# EAGLE schematic mrShark 01.a (EAGLE 6.1)
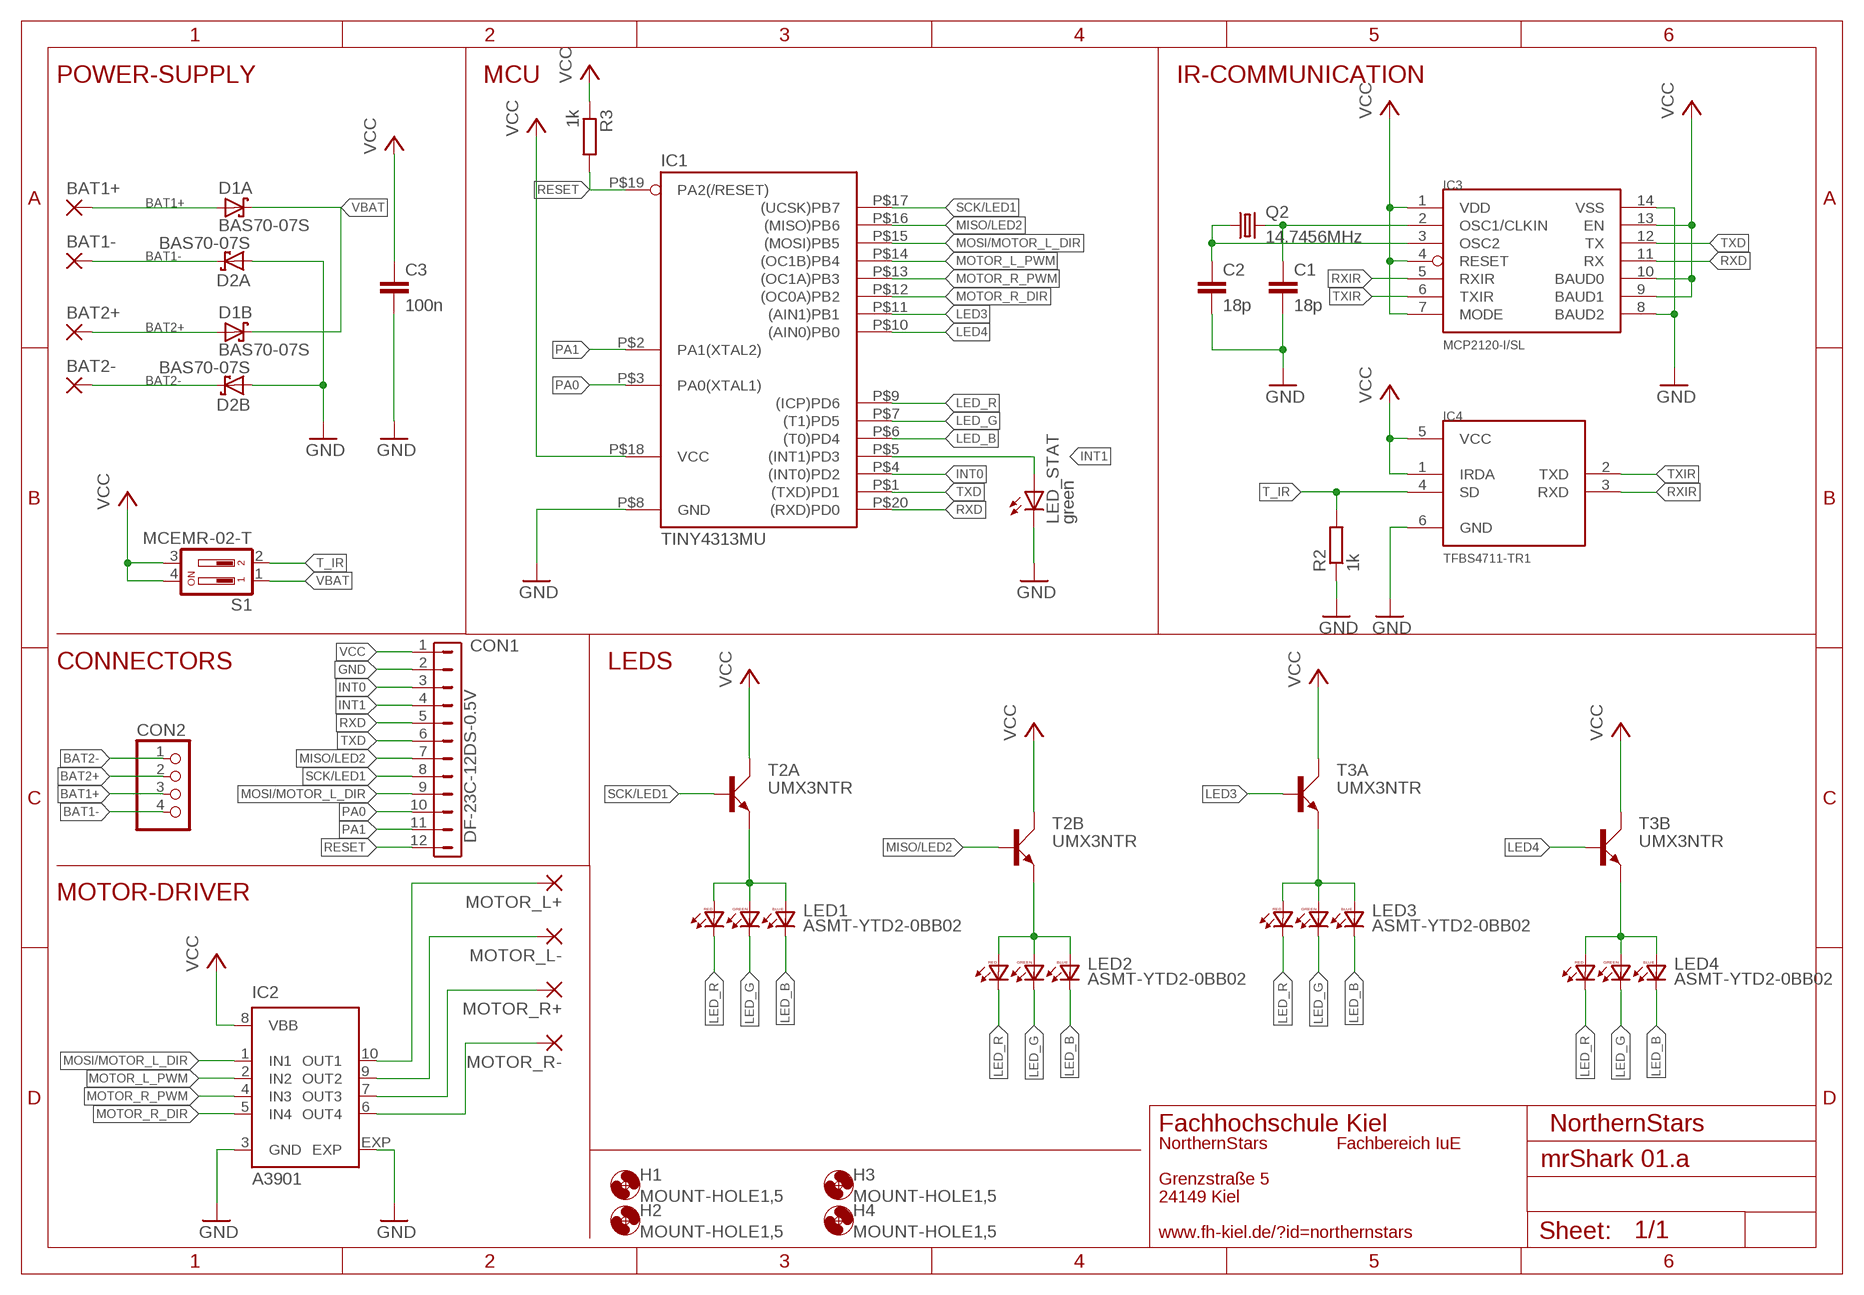
[diagram p0: schematic, sheet 1]

## Parts
BAT1+  SMD1  [SMD0,635-1,27]
BAT1-  SMD1  [SMD0,635-1,27]
BAT2+  SMD1  [SMD0,635-1,27]
BAT2-  SMD1  [SMD0,635-1,27]
C1  18p  C-EUC0402K  [C0402K]
C2  18p  C-EUC0402K  [C0402K]
C3  100n  C-EUC0402K  [C0402K]
CON1  DF-23C-12DS-0.5V  [DF23C-12DS]
CON2  PINHD-1X04_2.54-S  [1X04-S]
D1  BAS70-07S  [SOT363_PHILIPS]
D2  BAS70-07S  [SOT363_PHILIPS]
H1  MOUNT-HOLE1,5  [1,5]
H2  MOUNT-HOLE1,5  [1,5]
H3  MOUNT-HOLE1,5  [1,5]
H4  MOUNT-HOLE1,5  [1,5]
IC1  TINY4313MU  [MLF20]
IC2  A3901  [DFN10-3X3]
IC3  MCP2120-I/SL  MCP2120  [SO-14]
IC4  TFBS4711-TR1  TFBS4711TR1  [TFBS4711]
LED1  ASMT-YTD2-0BB02  PLCC6  [PLCC6]
LED2  ASMT-YTD2-0BB02  PLCC6  [PLCC6]
LED3  ASMT-YTD2-0BB02  PLCC6  [PLCC6]
LED4  ASMT-YTD2-0BB02  PLCC6  [PLCC6]
LED_STAT  green  LEDCHIP-LED0603  [CHIP-LED0603]
MOTOR_L+  SMD1  [SMD0,635-1,27]
MOTOR_L-  SMD1  [SMD0,635-1,27]
MOTOR_R+  SMD1  [SMD0,635-1,27]
MOTOR_R-  SMD1  [SMD0,635-1,27]
Q2  14.7456MHz  CRYSTALCFPX-104  [CFPX-104]
R2  1k  R-EU_R0402  [R0402]
R3  1k  R-EU_R0402  [R0402]
S1  MCEMR-02-T  219-02  [CTS-219-02]
T2  UMX3NTR  UMX3NTR-SOT363  [SOT363_INFINEON]
T3  UMX3NTR  UMX3NTR-SOT363  [SOT363_INFINEON]

## Nets
BAT1+: BAT1+.P$1(P) CON2.3 D1.1(A:A)
BAT1-: BAT1-.P$1(P) CON2.4 D2.6(A:C)
BAT2+: BAT2+.P$1(P) CON2.2 D1.4(B:A)
BAT2-: BAT2-.P$1(P) CON2.1 D2.3(B:C)
GND: C1.2 C2.2 C3.2 CON1.2 D2.1(A:A) D2.4(B:A) IC1.P$8(GND) IC2.3(GND) IC2.EXP IC3.8(BAUD2) IC3.14(VSS) IC4.6(GND) LED_STAT.C R2.1
INT0: CON1.3 IC1.P$4((INT0)PD2)
INT1: CON1.4 IC1.P$5((INT1)PD3) LED_STAT.A
LED1+: LED1.4(RA) LED1.5(GA) LED1.6(BA) T2.1(A:E)
LED2+: LED2.4(RA) LED2.5(GA) LED2.6(BA) T2.5(B:E)
LED3: IC1.P$11((AIN1)PB1) T3.2(A:B)
LED3+: LED3.4(RA) LED3.5(GA) LED3.6(BA) T3.1(A:E)
LED4: IC1.P$10((AIN0)PB0) T3.3(B:B)
LED4+: LED4.4(RA) LED4.5(GA) LED4.6(BA) T3.5(B:E)
LED_B: IC1.P$6((T0)PD4) LED1.1(BC) LED2.1(BC) LED3.1(BC) LED4.1(BC)
LED_G: IC1.P$7((T1)PD5) LED1.2(GC) LED2.2(GC) LED3.2(GC) LED4.2(GC)
LED_R: IC1.P$9((ICP)PD6) LED1.3(RC) LED2.3(RC) LED3.3(RC) LED4.3(RC)
MISO/LED2: CON1.7 IC1.P$16((MISO)PB6) T2.3(B:B)
MOSI/MOTOR_L_DIR: CON1.9 IC1.P$15((MOSI)PB5) IC2.1(IN1)
MOTOR_L+: IC2.10(OUT1) MOTOR_L+.P$1(P)
MOTOR_L-: IC2.9(OUT2) MOTOR_L-.P$1(P)
MOTOR_L_PWM: IC1.P$14((OC1B)PB4) IC2.2(IN2)
MOTOR_R+: IC2.7(OUT3) MOTOR_R+.P$1(P)
MOTOR_R-: IC2.6(OUT4) MOTOR_R-.P$1(P)
MOTOR_R_DIR: IC1.P$12((OC0A)PB2) IC2.5(IN4)
MOTOR_R_PWM: IC1.P$13((OC1A)PB3) IC2.4(IN3)
N$1: C2.1 IC3.3(OSC2) Q2.P$1
N$2: C1.1 IC3.2(OSC1/CLKIN) Q2.P$2
PA0: CON1.10 IC1.P$3(PA0(XTAL1))
PA1: CON1.11 IC1.P$2(PA1(XTAL2))
RESET: CON1.12 IC1.P$19(PA2(/RESET)) R3.2
RXD: CON1.5 IC1.P$20((RXD)PD0) IC3.11(RX)
RXIR: IC3.5(RXIR) IC4.3(RXD)
SCK/LED1: CON1.8 IC1.P$17((UCSK)PB7) T2.2(A:B)
T_IR: IC4.4(SD) R2.2 S1.2
TXD: CON1.6 IC1.P$1((TXD)PD1) IC3.12(TX)
TXIR: IC3.6(TXIR) IC4.2(TXD)
VBAT: D1.3(B:C) D1.6(A:C) S1.1
VCC: C3.1 CON1.1 IC1.P$18(VCC) IC2.8(VBB) IC3.1(VDD) IC3.4(RESET) IC3.7(MODE) IC3.9(BAUD1) IC3.10(BAUD0) IC3.13(EN) IC4.1(IRDA) IC4.5(VCC) R3.1 S1.3 S1.4 T2.4(B:C) T2.6(A:C) T3.4(B:C) T3.6(A:C)

## Notes on the sheet
- POWER-SUPPLY | MCU | IR-COMMUNICATION
- CONNECTORS | LEDS
- MOTOR-DRIVER
- Fachhochschule Kiel | NorthernStars
- NorthernStars | Fachbereich IuE
- Grenzstraße 5
- 24149 Kiel
- www.fh-kiel.de/?id=northernstars

## Library data of the parts
BAT1+ BAT1- BAT2+ BAT2- MOTOR_L+ MOTOR_L- MOTOR_R+ MOTOR_R- = wirepad:SMD1: SMD PAD Size: 0,635x1,27mm
C1-C3 = rcl:C-EU: CAPACITOR, European symbol
CON1 = con-hirose:DF-23C-12DS: Low-Profile Board-to-Board/Board-to-FPC Connectors 0.5mm Pitch 12-Pins Steckbuchse
CON2 = pinhead-2:PINHD-1X04: PIN HEADER
D1 D2 = diode:BAS70-07: Silicon Schottky Diodes General-purpose diode for high-speed switching Source: BAS70_1PS7XSB70_SER_8.pdf
H1-H4 = holes:MOUNT-HOLE: MOUNTING HOLE with drill center marker
IC1 = avr-6:TINY4313: Atmel ATtiny 4313 Microcontroller 4 kBytes Flash 256 Bytes SRAM 256 Bytes EEPROM
IC2 = allegro:A3901: Dual Full Bridge Low Voltage Motor Driver Source: www.allegromicro.com .. 3901.pdf
IC3 = microchip:MCP2120
IC4 = vishay:TFBS4711: TRANSCEIVER IRDA Vishay TFBS4711-TR1 Infrared Transciever 900nm, 600µA, 1m range
LED1-LED4 = led:PLCC6: Standart PLCC6 Package RGB LED
LED_STAT = led:LED: LED OSRAM: - CHIPLED LG R971, LG N971, LY N971, LG Q971, LY Q971, LO R971, LY R971 LH N974, LH R974 LS Q976, LO Q976, LY Q976 LO Q996 - Hyper CHIPLED LW Q18S LB Q993, LB Q99A, LB R99A - SideLED LS A670, LO A670, LY A670, LG A670, LP A670 LB A673, LV A673, LT A673, LW A673 LH A674 LY A675 LS A676, LA A676, LO A676, LY A676, LW A676 LS A679, LY A679, LG A679 - Hyper Micro SIDELED® LS Y876, LA Y876, LO Y876, LY Y876 LT Y87S - SmartLED LW L88C, LW L88S LB L89C, LB L89S, LG L890 LS L89K, LO L89K, LY L89K LS L896, LA L896, LO L896, LY L896 - TOPLED LS T670, LO T670, LY T670, LG T670, LP T670 LSG T670, LSP T670, LSY T670, LOP T670, LYG T670 LG T671, LOG T671, LSG T671 LB T673, LV T673, LT T673, LW T673 LH T674 LS T676, LA T676, LO T676, LY T676, LB T676, LH T676, LSB T676, LW T676 LB T67C, LV T67C, LT T67C, LS T67K, LO T67K, LY T67K, LW E67C LS E67B, LA E67B, LO E67B, LY E67B, LB E67C, LV E67C, LT E67C LW T67C LS T679, LY T679, LG T679 LS T770, LO T770, LY T770, LG T770, LP T770 LB T773, LV T773, LT T773, LW T773 LH T774 LS E675, LA E675, LY E675, LS T675 LS T776, LA T776, LO T776, LY T776, LB T776 LHGB T686 LT T68C, LB T68C - Hyper Mini TOPLED® LB M676 - Mini TOPLED Santana® LG M470 LS M47K, LO M47K, LY M47K Source: http://www.osram.convergy.de LUXEON: - LUMILED® LXK2-PW12-R00, LXK2-PW12-S00, LXK2-PW14-U00, LXK2-PW14-V00 LXK2-PM12-R00, LXK2-PM12-S00, LXK2-PM14-U00 LXK2-PE12-Q00, LXK2-PE12-R00, LXK2-PE12-S00, LXK2-PE14-T00, LXK2-PE14-U00 LXK2-PB12-K00, LXK2-PB12-L00, LXK2-PB12-M00, LXK2-PB14-N00, LXK2-PB14-P00, LXK2-PB14-Q00 LXK2-PR12-L00, LXK2-PR12-M00, LXK2-PR14-Q00, LXK2-PR14-R00 LXK2-PD12-Q00, LXK2-PD12-R00, LXK2-PD12-S00 LXK2-PH12-R00, LXK2-PH12-S00 LXK2-PL12-P00, LXK2-PL12-Q00, LXK2-PL12-R00 Source: www.luxeon.com KINGBRIGHT: KA-3528ASYC Source: www.kingbright.com
Q2 = crystal:CRYSTAL: CRYSTAL
R2 R3 = rcl:R-EU_: RESISTOR, European symbol
S1 = switch-dil:219-02*: Surface Mount DIP Switch Series 219 SMT CTS Electronic Components Sourc: www.ctscorp.com
T2 T3 = transistor-small-signal:UMX3NTR: DUAL NPN Transistor UMX3NTR Uce = 50V Ic = 150mA Pd = 150mW